# EAGLE schematic Sending end (EAGLE 6.3)
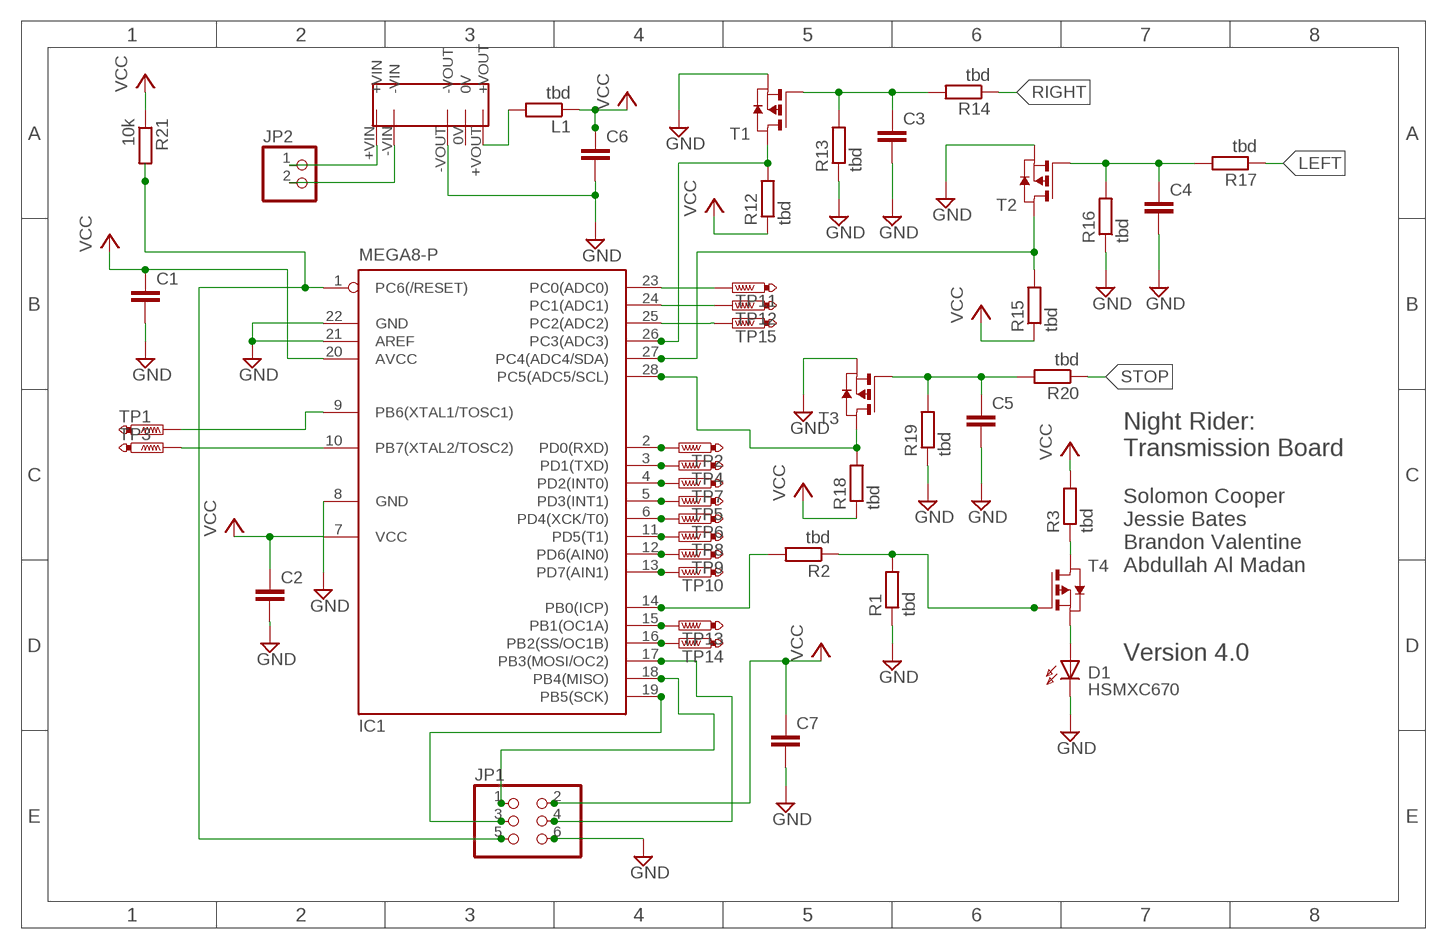
[diagram p0: schematic, sheet 1]

## Parts
C1  C-EUC0805  [C0805]
C2  C-EUC0805  [C0805]
C3  C-EUC0805  [C0805]
C4  C-EUC0805  [C0805]
C5  C-EUC0805  [C0805]
C6  C-EUC0805  [C0805]
C7  C-EUC0805  [C0805]
D1  HSMXC670  [HSMXC670]
IC1  MEGA8-P  [DIL28-3]
JP1  PINHD-2X3  [2X03]
JP2  PINHD-1X2  [1X02]
L1  tbd  R-EU_M0805  [M0805]
R1  tbd  R-EU_M0805  [M0805]
R2  tbd  R-EU_M0805  [M0805]
R3  tbd  R-EU_M0805  [M0805]
R12  tbd  R-EU_M0805  [M0805]
R13  tbd  R-EU_M0805  [M0805]
R14  tbd  R-EU_M0805  [M0805]
R15  tbd  R-EU_M0805  [M0805]
R16  tbd  R-EU_M0805  [M0805]
R17  tbd  R-EU_M0805  [M0805]
R18  tbd  R-EU_M0805  [M0805]
R19  tbd  R-EU_M0805  [M0805]
R20  tbd  R-EU_M0805  [M0805]
R21  10k  R-EU_M0805  [M0805]
T1  PMOSSOT23  [SOT-23]
T2  PMOSSOT23  [SOT-23]
T3  PMOSSOT23  [SOT-23]
T4  PMOSSOT23  [SOT-23]
TP1  PTR1PAD1-20  [P1-20]
TP2  PTR1PAD1-20  [P1-20]
TP3  PTR1PAD1-20  [P1-20]
TP4  PTR1PAD1-20  [P1-20]
TP5  PTR1PAD1-20  [P1-20]
TP6  PTR1PAD1-20  [P1-20]
TP7  PTR1PAD1-20  [P1-20]
TP8  PTR1PAD1-20  [P1-20]
TP9  PTR1PAD1-20  [P1-20]
TP10  PTR1PAD1-20  [P1-20]
TP11  PTR1PAD1-20  [P1-20]
TP12  PTR1PAD1-20  [P1-20]
TP13  PTR1PAD1-20  [P1-20]
TP14  PTR1PAD1-20  [P1-20]
TP15  PTR1PAD1-20  [P1-20]
U$1  NKA1205SC  [NKA1205SC]

## Nets
GND: C1.2 C2.2 C3.2 C4.2 C5.2 C6.2 C7.2 D1.K(C) IC1.8(GND) IC1.21(AREF) IC1.22(GND) JP1.6 R1.1 R13.1 R16.1 R19.1 T1.2(S) T2.2(S) T3.2(S) U$1.-VOUT
LEFT: R17.1
N$1: IC1.5(PD3(INT1)) TP5.TP
N$2: R1.2 R2.1 T4.3(G)
N$3: R3.1 T4.1(D)
N$5: IC1.2(PD0(RXD)) TP2.TP
N$6: D1.A T4.2(S)
N$7: IC1.1(PC6(/RESET)) JP1.5 R21.2
N$8: L1.2 U$1.+VOUT
N$11: C3.1 R13.2 R14.2 T1.3(G)
N$12: IC1.9(PB6(XTAL1/TOSC1)) TP1.TP
N$13: IC1.28(PC5(ADC5/SCL)) R18.2 T3.1(D)
N$15: IC1.3(PD1(TXD)) TP4.TP
N$16: IC1.4(PD2(INT0)) TP7.TP
N$17: IC1.6(PD4(XCK/T0)) TP6.TP
N$18: IC1.12(PD6(AIN0)) TP9.TP
N$19: IC1.13(PD7(AIN1)) TP10.TP
N$20: IC1.14(PB0(ICP)) R2.2
N$21: IC1.15(PB1(OC1A)) TP13.TP
N$22: IC1.16(PB2(SS/OC1B)) TP14.TP
N$23: IC1.17(PB3(MOSI/OC2)) JP1.4
N$24: IC1.18(PB4(MISO)) JP1.1
N$25: IC1.19(PB5(SCK)) JP1.3
N$26: JP2.2 U$1.-VIN
N$27: IC1.23(PC0(ADC0)) TP11.TP
N$28: IC1.24(PC1(ADC1)) TP12.TP
N$29: IC1.25(PC2(ADC2)) TP15.TP
N$30: JP2.1 U$1.+VIN
N$34: C4.1 R16.2 R17.2 T2.3(G)
N$35: IC1.27(PC4(ADC4/SDA)) R15.2 T2.1(D)
N$37: C5.1 R19.2 R20.2 T3.3(G)
N$39: IC1.10(PB7(XTAL2/TOSC2)) TP3.TP
N$40: IC1.11(PD5(T1)) TP8.TP
N$41: IC1.26(PC3(ADC3)) R12.2 T1.1(D)
RIGHT: R14.1
STOP: R20.1
VCC: C1.1 C2.1 C6.1 C7.1 IC1.7(VCC) IC1.20(AVCC) JP1.2 L1.1 R3.2 R12.1 R15.1 R18.1 R21.1
Unconnected: U$1.0V

## Notes on the sheet
- Night Rider: 
  Transmission Board
- Solomon Cooper 
  Jessie Bates
  Brandon Valentine
  Abdullah Al Madan
- Version 4.0

## Library data of the parts
C1-C7 = rcl:C-EU: CAPACITOR, European symbol
D1 = opto-transmittter-hp:HSMXC670: OPTO TRANSMITTER; OC_FARNELL: unknown; OC_NEWARK: unknown
IC1 = atmel:MEGA8-P: MICROCONTROLLER 8 Kbytes FLASH, 1 kbytes SRAM, 512 bytes EEPROM, USART, 4-channel 10 bit ADC, 2-channel 8 bit ADC Pin compatible with Atmega48, ATMega88, ATMega168 Source: avr.lbr; OC_FARNELL: unknown; OC_NEWARK: unknown
JP1 = pinhead:PINHD-2X3: PIN HEADER
JP2 = pinhead:PINHD-1X2: PIN HEADER
L1 R1-R3 R12-R21 = resistor:R-EU_: RESISTOR, European symbol
T1-T4 = zetex:PMOSSOT23: MOS FET; OC_FARNELL: unknown; OC_NEWARK: unknown
TP1-TP15 = testpad:PTR1: TEST PIN
U$1 = nka1205sc:NKA1205SC